# EAGLE design MCP23017_I8O4_v1_0 (EAGLE 9.6.2)
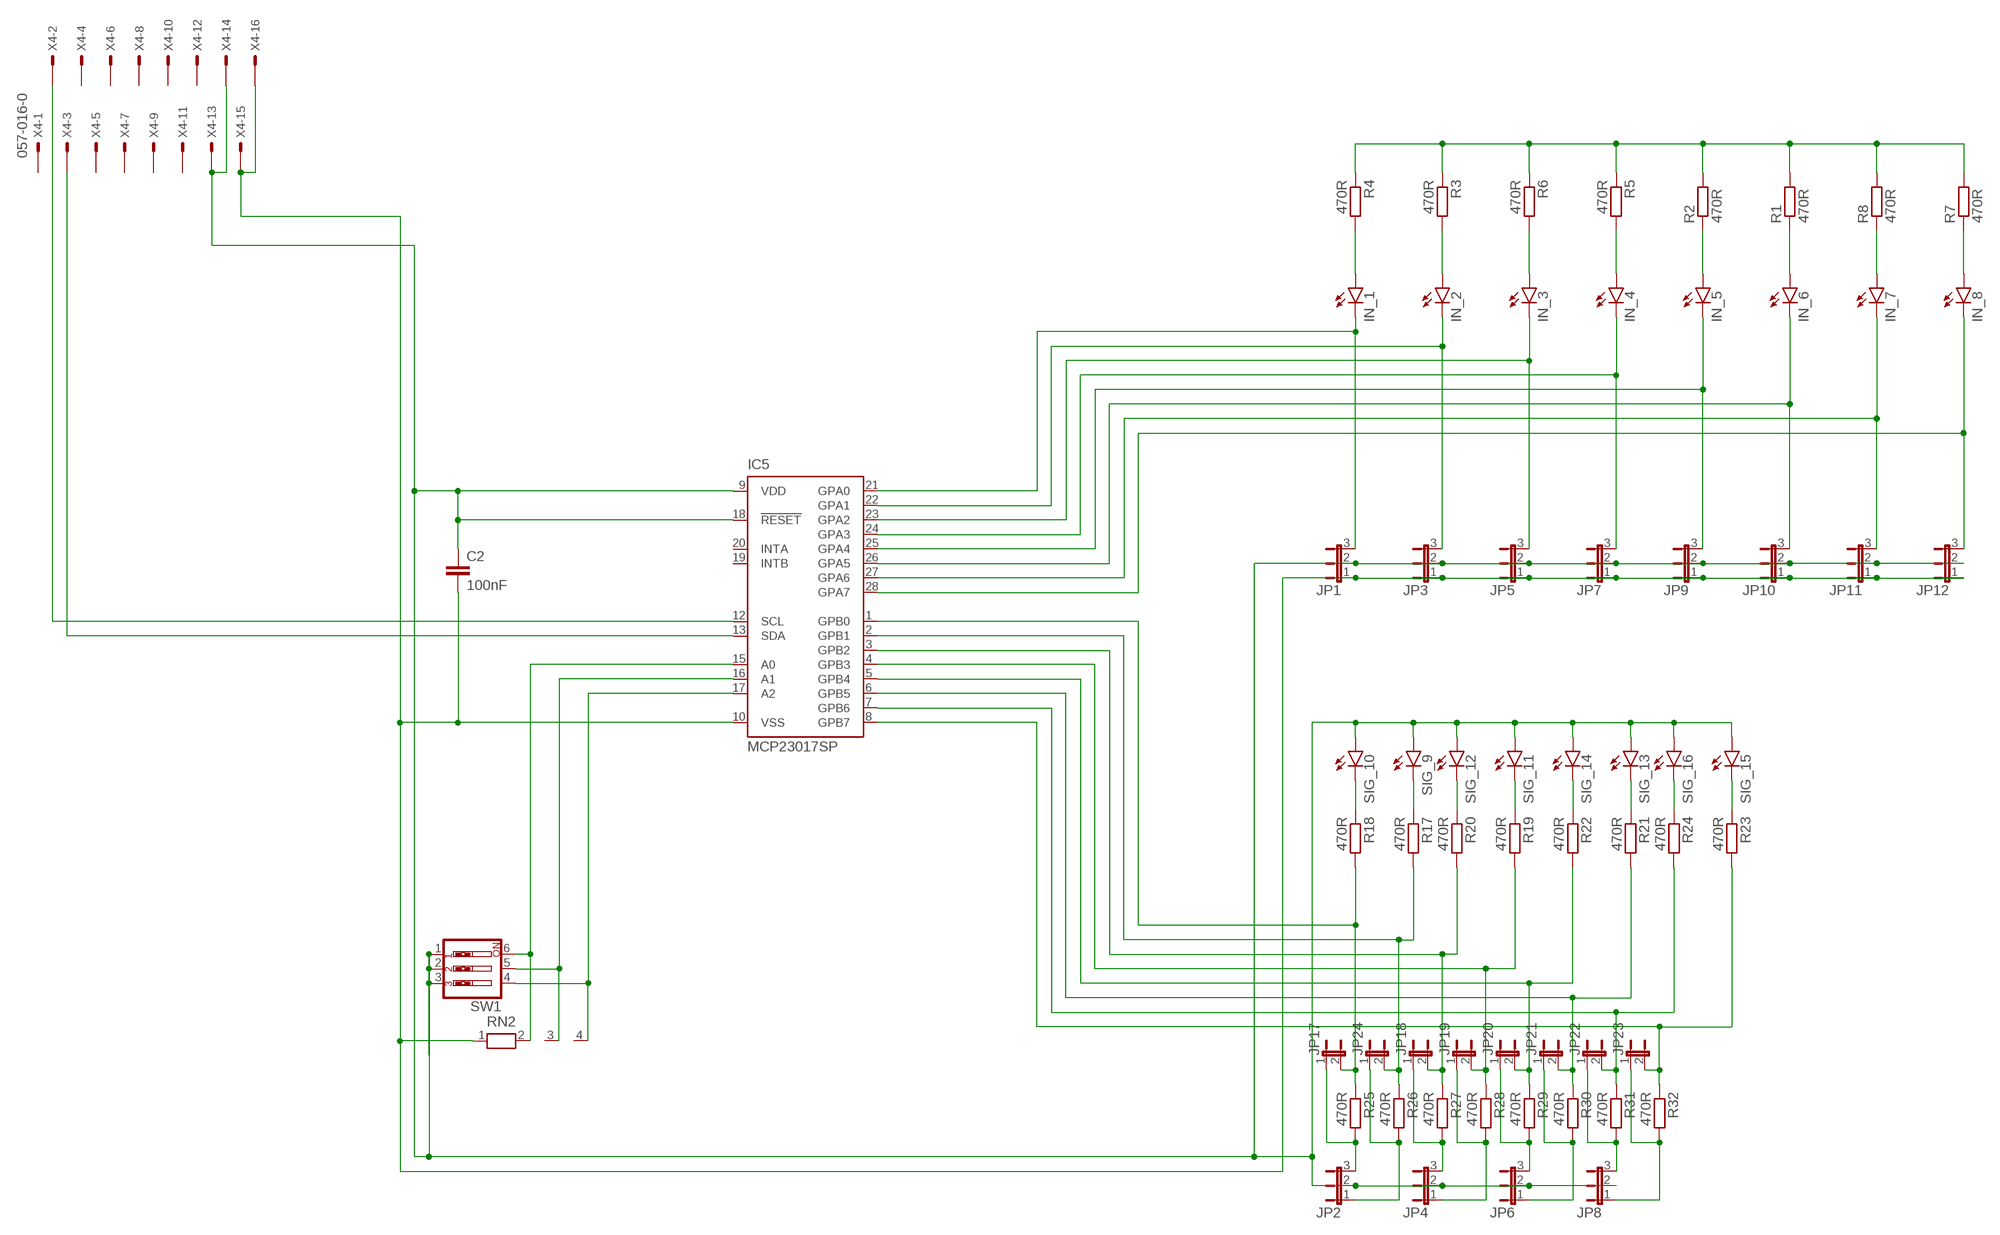
[diagram p0: schematic, sheet 1]

## Parts
C2  100nF  C-EU025-024X044  [C025-024X044]
IC5  MCP23017SP  [DIL28-3]
IN_1  LED3MM  [LED3MM]
IN_2  LED3MM  [LED3MM]
IN_3  LED3MM  [LED3MM]
IN_4  LED3MM  [LED3MM]
IN_5  LED3MM  [LED3MM]
IN_6  LED3MM  [LED3MM]
IN_7  LED3MM  [LED3MM]
IN_8  LED3MM  [LED3MM]
JP1  JP2E  [JP2]
JP2  JP2E  [JP2]
JP3  JP2E  [JP2]
JP4  JP2E  [JP2]
JP5  JP2E  [JP2]
JP6  JP2E  [JP2]
JP7  JP2E  [JP2]
JP8  JP2E  [JP2]
JP9  JP2E  [JP2]
JP10  JP2E  [JP2]
JP11  JP2E  [JP2]
JP12  JP2E  [JP2]
JP17  JP1E  [JP1]
JP18  JP1E  [JP1]
JP19  JP1E  [JP1]
JP20  JP1E  [JP1]
JP21  JP1E  [JP1]
JP22  JP1E  [JP1]
JP23  JP1E  [JP1]
JP24  JP1E  [JP1]
R1  470R  R-EU_0309/10  [0309/10]
R2  470R  R-EU_0309/10  [0309/10]
R3  470R  R-EU_0309/10  [0309/10]
R4  470R  R-EU_0309/10  [0309/10]
R5  470R  R-EU_0309/10  [0309/10]
R6  470R  R-EU_0309/10  [0309/10]
R7  470R  R-EU_0309/10  [0309/10]
R8  470R  R-EU_0309/10  [0309/10]
R17  470R  R-EU_0309/10  [0309/10]
R18  470R  R-EU_0309/10  [0309/10]
R19  470R  R-EU_0309/10  [0309/10]
R20  470R  R-EU_0309/10  [0309/10]
R21  470R  R-EU_0309/10  [0309/10]
R22  470R  R-EU_0309/10  [0309/10]
R23  470R  R-EU_0309/10  [0309/10]
R24  470R  R-EU_0309/10  [0309/10]
R25  470R  R-EU_0309/10  [0309/10]
R26  470R  R-EU_0309/10  [0309/10]
R27  470R  R-EU_0309/10  [0309/10]
R28  470R  R-EU_0309/10  [0309/10]
R29  470R  R-EU_0309/10  [0309/10]
R30  470R  R-EU_0309/10  [0309/10]
R31  470R  R-EU_0309/10  [0309/10]
R32  470R  R-EU_0309/10  [0309/10]
RN2  RN03  [RN-3]
SIG_9  LED3MM  [LED3MM]
SIG_10  LED3MM  [LED3MM]
SIG_11  LED3MM  [LED3MM]
SIG_12  LED3MM  [LED3MM]
SIG_13  LED3MM  [LED3MM]
SIG_14  LED3MM  [LED3MM]
SIG_15  LED3MM  [LED3MM]
SIG_16  LED3MM  [LED3MM]
SW1  SW_DIP-3  [EDG-03]
X4  057-016-0  [057-016-0]

## Nets
GND2: C2.2 IC5.10(VSS) JP1.1 JP3.1 JP5.1 JP7.1 JP9.1 JP10.1 JP11.1 JP12.1 RN2.1 X4.15 X4.16
N$2: IC5.22(GPA1) IN_2.K(C) JP3.3
N$4: IC5.24(GPA3) IN_4.K(C) JP7.3
N$6: IC5.17(A2) RN2.4 SW1.4
N$7: IC5.26(GPA5) IN_6.K(C) JP10.3
N$9: IC5.28(GPA7) IN_8.K(C) JP12.3
N$10: IN_8.A R7.1
N$11: IN_7.A R8.1
N$13: IN_6.A R1.1
N$21: IC5.21(GPA0) IN_1.K(C) JP1.3
N$23: IC5.23(GPA2) IN_3.K(C) JP5.3
N$25: IC5.25(GPA4) IN_5.K(C) JP9.3
N$27: IC5.27(GPA6) IN_7.K(C) JP11.3
N$29: IN_5.A R2.1
N$30: IN_4.A R5.2
N$31: IN_3.A R6.2
N$32: IN_2.A R3.2
N$33: IN_1.A R4.2
N$35: IC5.16(A1) RN2.3 SW1.5
N$50: IC5.2(GPB1) JP24.2 R17.2 R26.1
N$52: IC5.4(GPB3) JP19.2 R19.2 R28.1
N$56: IC5.6(GPB5) JP21.2 R21.2 R30.1
N$58: IC5.8(GPB7) JP23.2 R23.2 R32.1
N$59: IC5.1(GPB0) JP17.2 R18.2 R25.1
N$61: R18.1 SIG_10.K(C)
N$62: R17.1 SIG_9.K(C)
N$63: IC5.3(GPB2) JP18.2 R20.2 R27.1
N$65: IC5.5(GPB4) JP20.2 R22.2 R29.1
N$66: R20.1 SIG_12.K(C)
N$67: R19.1 SIG_11.K(C)
N$69: R22.1 SIG_14.K(C)
N$70: R21.1 SIG_13.K(C)
N$71: IC5.7(GPB6) JP22.2 R24.2 R31.1
N$72: R24.1 SIG_16.K(C)
N$73: R23.1 SIG_15.K(C)
N$74: JP2.3 JP17.1 R25.2
N$75: JP2.1 JP24.1 R26.2
N$76: JP4.3 JP18.1 R27.2
N$77: JP4.1 JP19.1 R28.2
N$78: JP6.3 JP20.1 R29.2
N$79: JP6.1 JP21.1 R30.2
N$80: JP8.3 JP22.1 R31.2
N$81: JP8.1 JP23.1 R32.2
N$82: IC5.12(SCL) X4.2
N$84: IC5.13(SDA) X4.3
N$85: IC5.15(A0) RN2.2 SW1.6
VCC5.1: C2.1 IC5.9(VDD) IC5.18(!RESET) JP1.2 JP2.2 JP3.2 JP4.2 JP5.2 JP6.2 JP7.2 JP8.2 JP9.2 JP10.2 JP11.2 JP12.2 SIG_9.A SIG_10.A SIG_11.A SIG_12.A SIG_13.A SIG_14.A SIG_15.A SIG_16.A SW1.1 SW1.2 SW1.3 X4.13 X4.14
VCC5.2: R1.2 R2.2 R3.1 R4.1 R5.1 R6.1 R7.2 R8.2
Unconnected: IC5.19(INTB) IC5.20(INTA) X4.1 X4.4 X4.5 X4.6 X4.7 X4.8 X4.9 X4.10 X4.11 X4.12

## Library data of the parts
C2 = resistor:C-EU: CAPACITOR, European symbol
IC5 = microchip-6:MCP23017: http://ww1.microchip.com/downloads/en/DeviceDoc/21952a.pdf Source: http://ww1.microchip.com/downloads/en/DeviceDoc/21952a.pdf
IN_1-IN_8 SIG_9-SIG_16 = led:LED: LED OSRAM: - CHIPLED LG R971, LG N971, LY N971, LG Q971, LY Q971, LO R971, LY R971 LH N974, LH R974 LS Q976, LO Q976, LY Q976 LO Q996 - Hyper CHIPLED LW Q18S LB Q993, LB Q99A, LB R99A - SideLED LS A670, LO A670, LY A670, LG A670, LP A670 LB A673, LV A673, LT A673, LW A673 LH A674 LY A675 LS A676, LA A676, LO A676, LY A676, LW A676 LS A679, LY A679, LG A679 - Hyper Micro SIDELED® LS Y876, LA Y876, LO Y876, LY Y876 LT Y87S - SmartLED LW L88C, LW L88S LB L89C, LB L89S, LG L890 LS L89K, LO L89K, LY L89K LS L896, LA L896, LO L896, LY L896 - TOPLED LS T670, LO T670, LY T670, LG T670, LP T670 LSG T670, LSP T670, LSY T670, LOP T670, LYG T670 LG T671, LOG T671, LSG T671 LB T673, LV T673, LT T673, LW T673 LH T674 LS T676, LA T676, LO T676, LY T676, LB T676, LH T676, LSB T676, LW T676 LB T67C, LV T67C, LT T67C, LS T67K, LO T67K, LY T67K, LW E67C LS E67B, LA E67B, LO E67B, LY E67B, LB E67C, LV E67C, LT E67C LW T67C LS T679, LY T679, LG T679 LS T770, LO T770, LY T770, LG T770, LP T770 LB T773, LV T773, LT T773, LW T773 LH T774 LS E675, LA E675, LY E675, LS T675 LS T776, LA T776, LO T776, LY T776, LB T776 LHGB T686 LT T68C, LB T68C - Hyper Mini TOPLED® LB M676 - Mini TOPLED Santana® LG M470 LS M47K, LO M47K, LY M47K Source: http://www.osram.convergy.de LUXEON: - LUMILED® LXK2-PW12-R00, LXK2-PW12-S00, LXK2-PW14-U00, LXK2-PW14-V00 LXK2-PM12-R00, LXK2-PM12-S00, LXK2-PM14-U00 LXK2-PE12-Q00, LXK2-PE12-R00, LXK2-PE12-S00, LXK2-PE14-T00, LXK2-PE14-U00 LXK2-PB12-K00, LXK2-PB12-L00, LXK2-PB12-M00, LXK2-PB14-N00, LXK2-PB14-P00, LXK2-PB14-Q00 LXK2-PR12-L00, LXK2-PR12-M00, LXK2-PR14-Q00, LXK2-PR14-R00 LXK2-PD12-Q00, LXK2-PD12-R00, LXK2-PD12-S00 LXK2-PH12-R00, LXK2-PH12-S00 LXK2-PL12-P00, LXK2-PL12-Q00, LXK2-PL12-R00 Source: www.luxeon.com KINGBRIGHT: KA-3528ASYC Source: www.kingbright.com
JP1-JP12 = jumper:JP2E: JUMPER
JP17-JP24 = jumper:JP1E: JUMPER
R1-R8 R17-R32 = resistor:R-EU_: RESISTOR, European symbol
RN2 = resistor-net_edit:RN03: RESISTOR NETWORK; OC_FARNELL: unknown; OC_NEWARK: unknown
SW1 = special:SW_DIP-3: DIP SWITCH
X4 = con-panduit:057-016-: CONNECTOR 10-pin series 057 contact pc board low profile headers; OC_FARNELL: unknown; OC_NEWARK: unknown

## Board
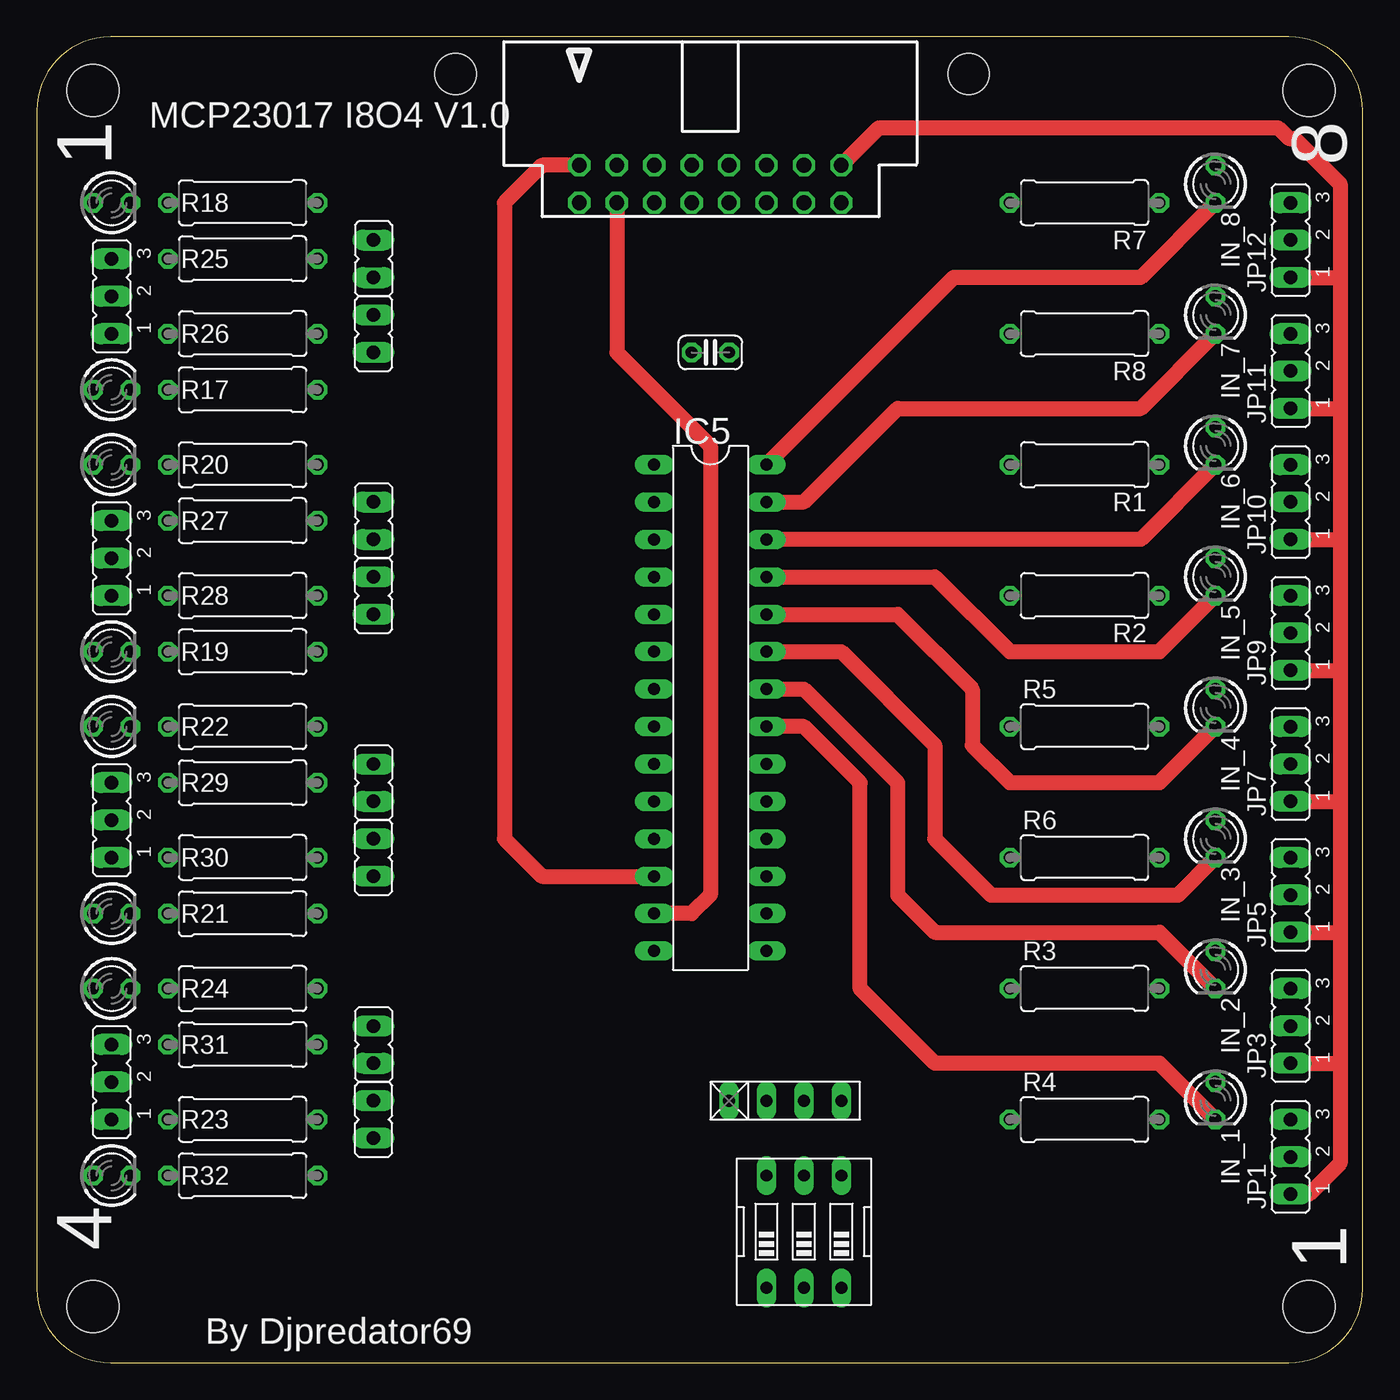
[diagram p1: board, top side]
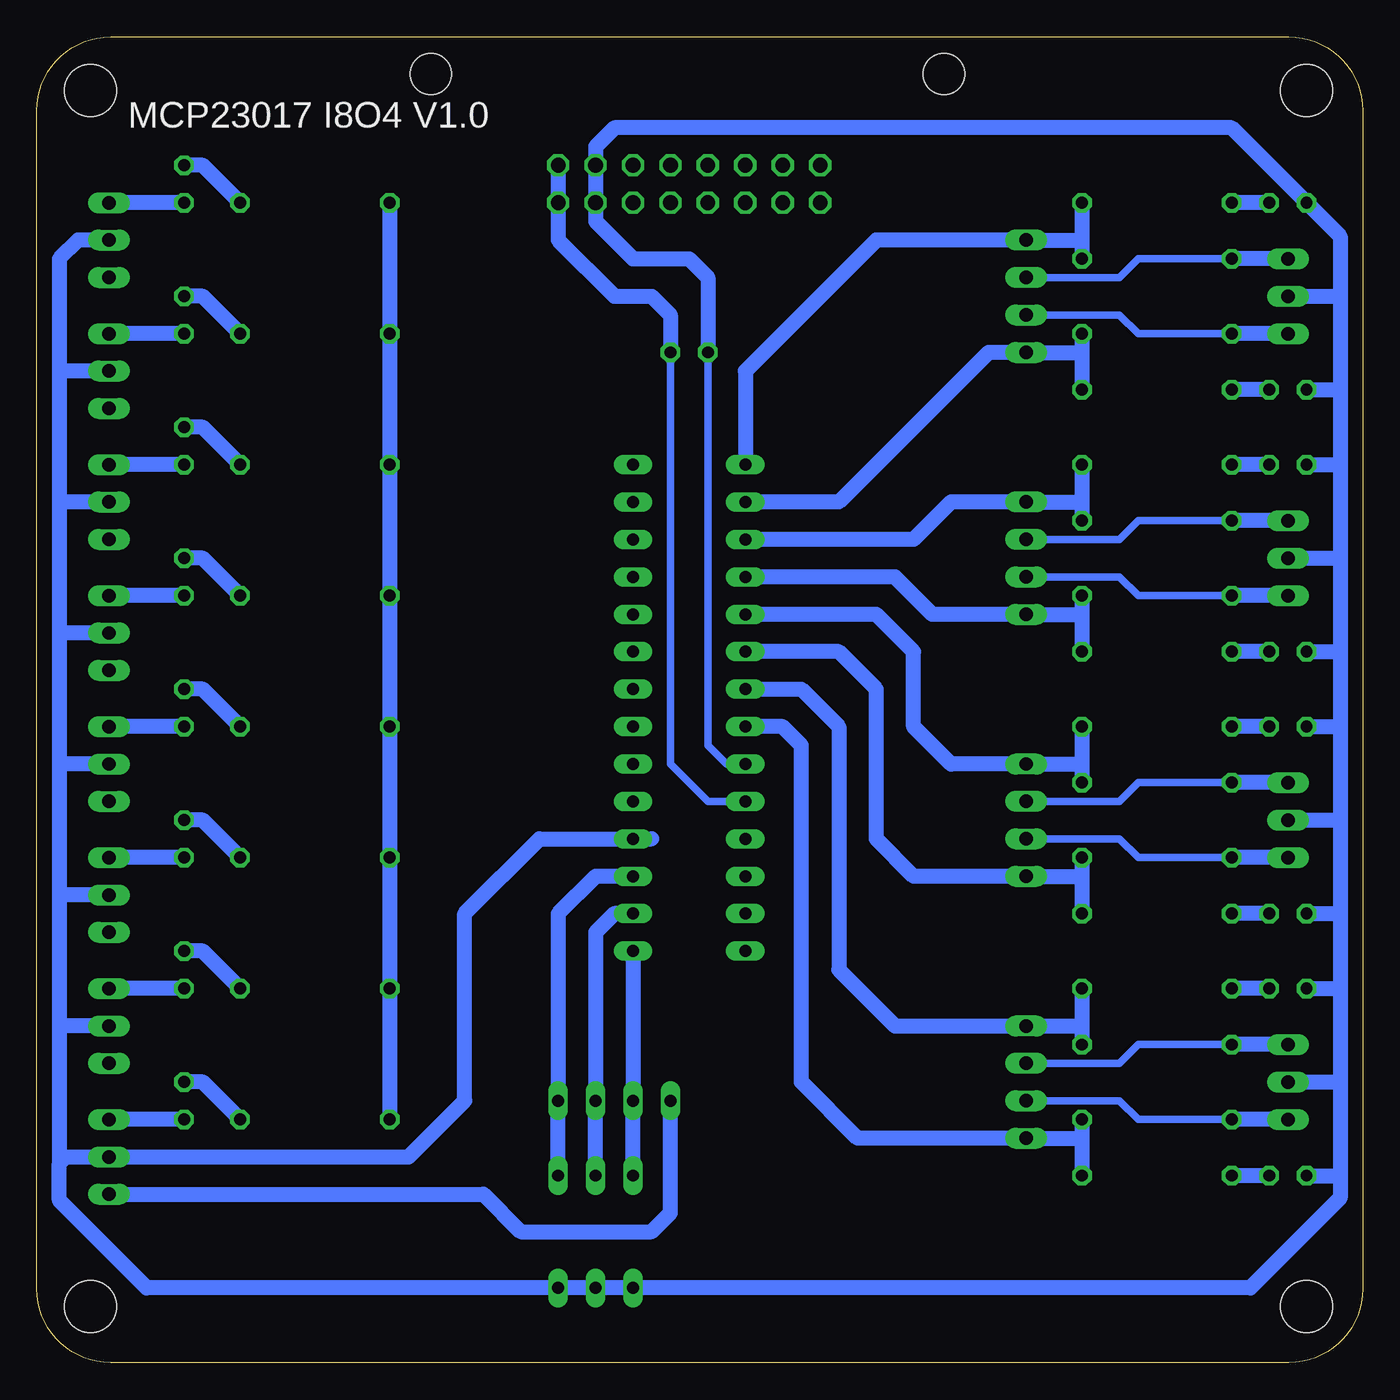
[diagram p2: board, bottom side, seen from below]

Size 90 x 90 mm. Coordinates in mm from the lower left corner, seen from the top.
Outline: 0,85 0,5 arc90 5,0 85,0 arc90 90,5 90,85 arc90 85,90 5,90 arc90 0,85
Copper layers (1*16): Top 0.035mm / dielectric 1.5mm / Bottom 0.035mm
Design rules "default": minimum track width 6mil, minimum drill 0.35mm, track to track 6mil, track to pad 6mil, pad to pad 6mil, via to via 6mil, smd to smd 6mil, copper to edge 40mil, drill to drill 6mil, minimum pad ring 10mil, minimum via ring 8mil, stop-mask expansion 4mil, vias tented up to drill 0mil, thermal gap 10mil
Holes 3.5 mm at 86.36,86.36 3.81,86.36 3.81,3.81 86.36,3.81

### Footprints (pad centres in the part's own frame; a part is rotated, then mirrored left to right if it is on the bottom)
C025-024X044 = drill 0.813 octagon: 1 -1.27,0; 2 1.27,0
DIL28-3 = drill 0.813 long: 1 -16.51,-3.81; 2 -13.97,-3.81; 3 -11.43,-3.81; 4 -8.89,-3.81; 5 -6.35,-3.81; 6 -3.81,-3.81; 7 -1.27,-3.81; 8 1.27,-3.81; 9 3.81,-3.81; 10 6.35,-3.81; 11 8.89,-3.81; 12 11.43,-3.81; 13 13.97,-3.81; 14 16.51,-3.81; 15 16.51,3.81; 16 13.97,3.81; 17 11.43,3.81; 18 8.89,3.81; 19 6.35,3.81; 20 3.81,3.81; 21 1.27,3.81; 22 -1.27,3.81; 23 -3.81,3.81; 24 -6.35,3.81; 25 -8.89,3.81; 26 -11.43,3.81; 27 -13.97,3.81; 28 -16.51,3.81
LED3MM = drill 0.813 octagon: A -1.27,0; K 1.27,0
JP2 = drill 0.914 long: 1 -2.54,0; 2 0,0; 3 2.54,0
JP1 = drill 0.914 long: 1 0,-1.27; 2 0,1.27
0309/10 = drill 0.813 octagon: 1 -5.08,0; 2 5.08,0
RN-3 = drill 0.813 long: 1 -5.08,0; 2 -2.54,0; 3 0,0; 4 2.54,0
EDG-03 = drill 0.813 long: 1 -2.54,-3.81; 2 0,-3.81; 3 2.54,-3.81; 4 2.54,3.81; 5 0,3.81; 6 -2.54,3.81
057-016-0 = drill 1 octagon: 1 -8.89,-5.08; 2 -8.89,-2.54; 3 -6.35,-5.08; 4 -6.35,-2.54; 5 -3.81,-5.08; 6 -3.81,-2.54; 7 -1.27,-5.08; 8 -1.27,-2.54; 9 1.27,-5.08; 10 1.27,-2.54; 11 3.81,-5.08; 12 3.81,-2.54; 13 6.35,-5.08; 14 6.35,-2.54; 15 8.89,-5.08; 16 8.89,-2.54 | hole 2.8: -17.29,3.66; 17.54,3.66

### Placement (x,y rotation side)
C2  45.72,68.58 0 top
IC5  45.72,44.45 270 top
IN_1  80.01,17.78 270 top
IN_2  80.01,26.67 270 top
IN_3  80.01,35.56 270 top
IN_4  80.01,44.45 270 top
IN_5  80.01,53.34 270 top
IN_6  80.01,62.23 270 top
IN_7  80.01,71.12 270 top
IN_8  80.01,80.01 270 top
JP1  85.09,13.97 90 top
JP2  5.08,72.39 90 top
JP3  85.09,22.86 90 top
JP4  5.08,54.61 90 top
JP5  85.09,31.75 90 top
JP6  5.08,36.83 90 top
JP7  85.09,40.64 90 top
JP8  5.08,19.05 90 top
JP9  85.09,49.53 90 top
JP10  85.09,58.42 90 top
JP11  85.09,67.31 90 top
JP12  85.09,76.2 90 top
JP17  22.86,74.93 0 top
JP18  22.86,57.15 0 top
JP19  22.86,52.07 180 top
JP20  22.86,39.37 0 top
JP21  22.86,34.29 180 top
JP22  22.86,21.59 0 top
JP23  22.86,16.51 180 top
JP24  22.86,69.85 180 top
R1  71.12,60.96 180 top
R2  71.12,52.07 180 top
R3  71.12,25.4 0 top
R4  71.12,16.51 0 top
R5  71.12,43.18 0 top
R6  71.12,34.29 0 top
R7  71.12,78.74 180 top
R8  71.12,69.85 180 top
R17  13.97,66.04 0 top
R18  13.97,78.74 0 top
R19  13.97,48.26 0 top
R20  13.97,60.96 0 top
R21  13.97,30.48 0 top
R22  13.97,43.18 0 top
R23  13.97,12.7 0 top
R24  13.97,25.4 0 top
R25  13.97,74.93 180 top
R26  13.97,69.85 180 top
R27  13.97,57.15 180 top
R28  13.97,52.07 180 top
R29  13.97,39.37 180 top
R30  13.97,34.29 180 top
R31  13.97,21.59 180 top
R32  13.97,16.51 180 top
RN2  52.07,17.78 0 top
SIG_9  5.08,66.04 0 top
SIG_10  5.08,78.74 0 top
SIG_11  5.08,48.26 0 top
SIG_12  5.08,60.96 0 top
SIG_13  5.08,30.48 0 top
SIG_14  5.08,43.18 0 top
SIG_15  5.08,12.7 0 top
SIG_16  5.08,25.4 0 top
SW1  52.07,8.89 0 top
X4  45.72,83.82 0 top

### Tracks (layer width: path | path; a pad name or v marks a point on that pad's centre or on a via)
GND2
  Top 1.016: X4.16 57.15,83.82 84.27,83.82 85,83.09 85.4,83.09 88.48,80.01 88.48,73.66 | 88.48,73.66 88.48,64.77 | 88.48,64.77 88.48,55.88 | 88.48,55.88 88.48,46.99 | 88.48,46.99 88.48,38.1 | 88.48,38.1 88.48,29.21 | 88.48,29.21 88.48,20.32 | 88.48,20.32 88.48,13.55 86.36,11.43 JP1.1 | JP3.1 88.48,20.32 | JP5.1 88.48,29.21 | JP7.1 88.48,38.1 | JP9.1 88.48,46.99 | JP10.1 88.48,55.88 | JP11.1 88.48,64.77 | JP12.1 88.48,73.66
  Bottom 0.508: IC5.10 44.45,38.1 46.99,40.64 C2.2
  Bottom 1.016: X4.16 X4.15 54.61,76.2 50.8,72.39 48.26,72.39 46.99,71.12 C2.2 | JP1.1 59.69,11.43 57.15,8.89 48.26,8.89 46.99,10.16 RN2.1
N$2
  Top 1.016: IC5.22 52.07,45.72 58.42,39.37 58.42,31.75 60.96,29.21 76.2,29.21 IN_2.K
  Bottom 1.016: IN_2.K JP3.3
N$4
  Top 1.016: IC5.24 58.42,50.8 63.5,45.72 63.5,41.91 66.04,39.37 76.2,39.37 IN_4.K
  Bottom 1.016: IN_4.K JP7.3
N$6
  Bottom 1.016: SW1.4 RN2.4 54.61,30.48 52.07,33.02 IC5.17
N$7
  Top 1.016: IN_6.K 74.93,55.88 IC5.26
  Bottom 1.016: IN_6.K JP10.3
N$9
  Top 1.016: IN_8.K 74.93,73.66 62.23,73.66 IC5.28
  Bottom 1.016: IN_8.K JP12.3
N$10
  Bottom 1.016: R7.1 78.74,81.28 IN_8.A
N$11
  Bottom 1.016: R8.1 78.74,72.39 IN_7.A
N$13
  Bottom 1.016: R1.1 78.74,63.5 IN_6.A
N$21
  Top 1.016: IC5.21 52.07,43.18 55.88,39.37 55.88,25.4 60.96,20.32 76.2,20.32 IN_1.K
  Bottom 1.016: IN_1.K JP1.3
N$23
  Top 1.016: IC5.23 54.61,48.26 60.96,41.91 60.96,35.56 64.77,31.75 77.47,31.75 IN_3.K
  Bottom 1.016: IN_3.K JP5.3
N$25
  Top 1.016: IC5.25 60.96,53.34 66.04,48.26 76.2,48.26 IN_5.K
  Bottom 1.016: IN_5.K JP9.3
N$27
  Top 1.016: IN_7.K 74.93,64.77 58.42,64.77 52.07,58.42 IC5.27
  Bottom 1.016: IN_7.K JP11.3
N$29
  Bottom 1.016: R2.1 78.74,54.61 IN_5.A
N$30
  Bottom 1.016: R5.2 78.74,45.72 IN_4.A
N$31
  Bottom 1.016: R6.2 78.74,36.83 IN_3.A
N$32
  Bottom 1.016: R3.2 78.74,27.94 IN_2.A
N$33
  Bottom 1.016: R4.2 78.74,19.05 IN_1.A
N$35
  Bottom 1.016: SW1.5 RN2.3 52.07,29.21 50.8,30.48 IC5.16
N$50
  Bottom 1.016: R26.1 19.05,68.58 | 19.05,68.58 R17.2 | 19.05,68.58 JP24.2 25.4,68.58 35.56,58.42 IC5.2
N$52
  Bottom 1.016: R28.1 19.05,50.8 | 19.05,50.8 R19.2 | 19.05,50.8 JP19.2 29.21,50.8 31.75,53.34 IC5.4
N$56
  Bottom 1.016: R30.1 19.05,33.02 | 19.05,33.02 R21.2 | 19.05,33.02 JP21.2 30.48,33.02 33.02,35.56 33.02,45.72 35.56,48.26 IC5.6
N$58
  Bottom 1.016: R32.1 19.05,15.24 | 19.05,15.24 R23.2 | 19.05,15.24 JP23.2 34.29,15.24 38.1,19.05 38.1,41.91 39.37,43.18 IC5.8
N$59
  Bottom 1.016: R18.2 19.05,76.2 | 19.05,76.2 R25.1 | 19.05,76.2 JP17.2 33.02,76.2 41.91,67.31 IC5.1
N$61
  Bottom 1.016: SIG_10.K R18.1
N$62
  Bottom 1.016: SIG_9.K R17.1
N$63
  Bottom 1.016: R20.2 19.05,58.42 | 19.05,58.42 R27.1 | 19.05,58.42 JP18.2 27.94,58.42 30.48,55.88 IC5.3
N$65
  Bottom 1.016: R22.2 19.05,40.64 | 19.05,40.64 R29.1 | 19.05,40.64 JP20.2 27.94,40.64 30.48,43.18 30.48,48.26 33.02,50.8 IC5.5
N$66
  Bottom 1.016: SIG_12.K R20.1
N$67
  Bottom 1.016: SIG_11.K R19.1
N$69
  Bottom 1.016: SIG_14.K R22.1
N$70
  Bottom 1.016: SIG_13.K R21.1
N$71
  Bottom 1.016: R24.2 19.05,22.86 | 19.05,22.86 R31.1 | 19.05,22.86 JP22.2 31.75,22.86 35.56,26.67 35.56,43.18 38.1,45.72 IC5.7
N$72
  Bottom 1.016: SIG_16.K R24.1
N$73
  Bottom 1.016: SIG_15.K R23.1
N$74
  Bottom 0.508: R25.2 15.24,74.93 16.51,73.66 JP17.1
  Bottom 1.016: JP2.3 R25.2
N$75
  Bottom 0.508: R26.2 15.24,69.85 16.51,71.12 JP24.1
  Bottom 1.016: JP2.1 R26.2
N$76
  Bottom 0.508: R27.2 15.24,57.15 16.51,55.88 JP18.1
  Bottom 1.016: JP4.3 R27.2
N$77
  Bottom 0.508: R28.2 15.24,52.07 16.51,53.34 JP19.1
  Bottom 1.016: JP4.1 R28.2
N$78
  Bottom 0.508: R29.2 15.24,39.37 16.51,38.1 JP20.1
  Bottom 1.016: JP6.3 R29.2
N$79
  Bottom 0.508: R30.2 15.24,34.29 16.51,35.56 JP21.1
  Bottom 1.016: JP6.1 R30.2
N$80
  Bottom 0.508: R31.2 15.24,21.59 16.51,20.32 JP22.1
  Bottom 1.016: JP8.3 R31.2
N$81
  Bottom 0.508: R32.2 15.24,16.51 16.51,17.78 JP23.1
  Bottom 1.016: JP8.1 R32.2
N$82
  Top 1.016: X4.2 34.29,81.28 31.75,78.74 31.75,35.56 34.29,33.02 IC5.12
N$84
  Top 1.016: IC5.13 44.45,30.48 45.72,31.75 45.72,62.23 39.37,68.58 X4.3
N$85
  Bottom 1.016: SW1.6 RN2.2 IC5.15
VCC5.1
  Bottom 0.508: IC5.9 43.18,40.64 44.45,41.91 C2.1
  Bottom 1.016: 1.52,72.39 1.52,76.45 SIG_10.A 8.89,83.82 50.8,83.82 52.07,82.55 X4.14 X4.13 52.07,77.47 49.53,74.93 45.72,74.93 44.45,73.66 C2.1 | 1.52,72.39 1.52,66.04 | 1.52,66.04 1.52,60.96 | 1.52,60.96 1.52,54.61 | 1.52,54.61 1.52,48.26 | 1.52,48.26 1.52,43.18 | 1.52,43.18 1.52,36.83 | 1.52,36.83 1.52,30.48 | 1.52,30.48 1.52,25.4 | 1.52,25.4 1.52,19.05 | 1.52,19.05 1.52,12.7 | SIG_16.A 1.52,25.4 | SIG_13.A 1.52,30.48 | JP8.2 1.52,19.05 | JP6.2 1.52,36.83 | SIG_14.A 1.52,43.18 | SIG_11.A 1.52,48.26 | JP4.2 1.52,54.61 | SIG_12.A 1.52,60.96 | SIG_9.A 1.52,66.04 | JP2.2 1.52,72.39 | JP12.2 87.21,76.2 88.48,74.93 88.48,67.31 | 88.48,67.31 88.48,58.42 | 88.48,58.42 88.48,49.53 | 88.48,49.53 88.48,40.64 | 88.48,40.64 88.48,31.75 | 88.48,31.75 88.48,22.86 | 88.48,22.86 88.48,13.55 | 88.48,13.55 88.05,13.97 JP1.2 64.77,13.97 60.96,17.78 60.96,30.48 55.88,35.56 IC5.18 48.26,35.56 | JP3.2 88.48,22.86 | JP5.2 88.48,31.75 | JP7.2 88.48,40.64 | JP9.2 88.48,49.53 | JP10.2 88.48,58.42 | JP11.2 88.48,67.31 | 88.48,13.55 88.48,11.01 82.55,5.08 SW1.3 SW1.2 SW1.1 7.62,5.08 1.52,11.18 1.52,12.7 | SIG_15.A 1.52,12.7
VCC5.2
  Bottom 1.016: R7.2 R8.2 R1.2 R2.2 R5.1 R6.1 R3.1 R4.1

### Text on the board
tNames: MCP23017 I8O4 V1.0 | 1 | 8 | 4 | 1 | By Djpredator69
bNames: MCP23017 I8O4 V1.0